# Altium schematic sheet tag.SchDoc
size 420 x 297 mm; SheetNumber: 1; SheetTotal: 1
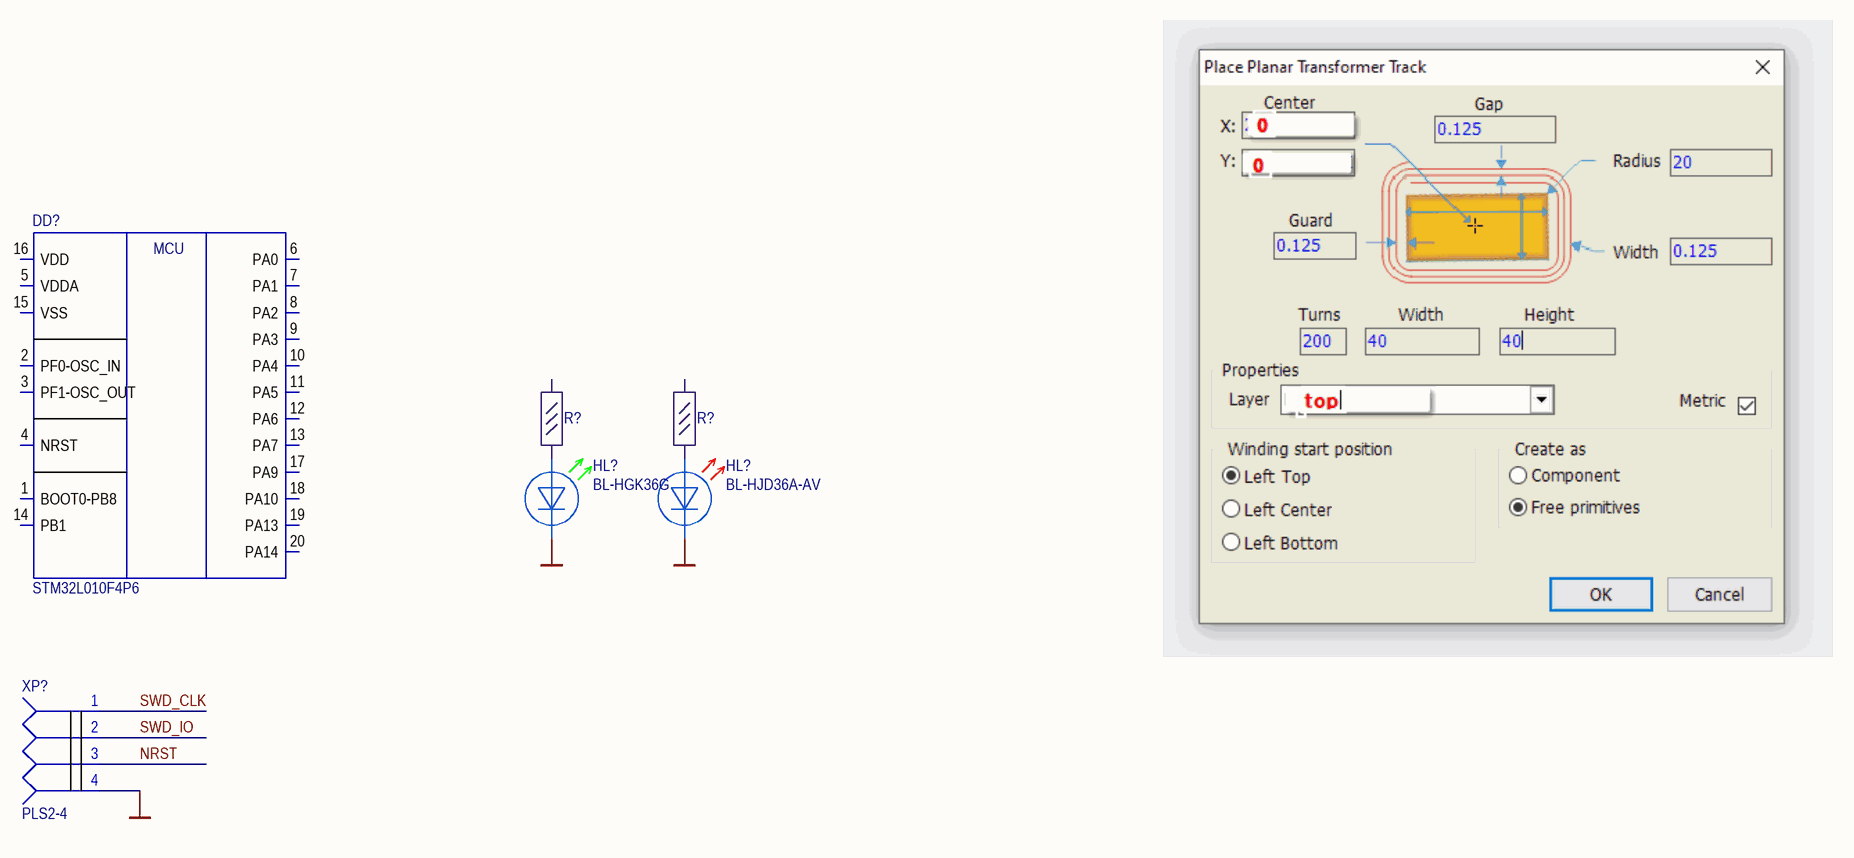
[diagram p0: tag.SchDoc]

## Parts
(Parts that share a designator on the sheet are numbered #1, #2 ... from top to bottom, then left to right.)
DD?  STM32L010F4P6  [TSSOP-20]
HL?#1  BL-HGK36G  [LED_0603_GREEN]
HL?#2  BL-HJD36A-AV  [LED_0603_RED]
R?#1  470  [R_0603]  (value not drawn)
R?#2  470  [R_0603]  (value not drawn)
XP?  PLS2-4  [PLS2-4]

## Nets
GND: HL?#1.2 HL?#2.2 XP?.4
NRST: XP?.3
SWD_CLK: XP?.1
SWD_IO: XP?.2
NetHL?#1_1: HL?#1.1 R?#1.1
NetHL?#2_1: HL?#2.1 R?#2.1

Not connected (* = marked no-connect by the designer): DD? 1(BOOT0-PB8) 2(PF0-OSC_IN) 3(PF1-OSC_OUT) 4(NRST) 5(VDDA) 6(PA0) 7(PA1) 8(PA2) 9(PA3) 10(PA4) 11(PA5) 12(PA6) 13(PA7) 14(PB1) 15(VSS) 16(VDD) 17(PA9) 18(PA10) 19(PA13) 20(PA14); R?#1 2; R?#2 2

## Notes on the sheet
- Перв.примен.
- Справ.№
- Подп. и дата
- Инв.№ дубл.
- Взам.инв.№
- Подп.и дата
- Разраб.
- Изм.
- Лист
- № докум.
- Подп.
- Дата
- Лит.
- Масштаб
- Масса
- Т.контр.
- Пров.
- СХЕМА   ЭЛЕКТРИЧЕСКАЯ
- ПРИНЦИПИАЛЬНАЯ
- Листов
- Инв.№ подл.
- Утв.
- Н.контр.
- Нач.сект.
- Формат  A3
- (in symbol STM32L010F4P6) MCU

## Library data of the parts
HL?#1 = BL-HGK36G: SMD LED 0603 TOP зеленый
HL?#2 = BL-HJD36A-AV: SMD LED 0603 TOP красный
R?#1 R?#2 = CR0603-FX-4700ELF: RES SMD 470 OHM 1% 1/10W 0603; Manufacturer: Bourns Inc.; Part Number: CR0603-FX-4700ELF; Value: 470; ComponentLink1URL: https://www.bourns.com/pdfs/chpreztr.pdf; ComponentLink1Description: Datasheet; Component Type: Resistor